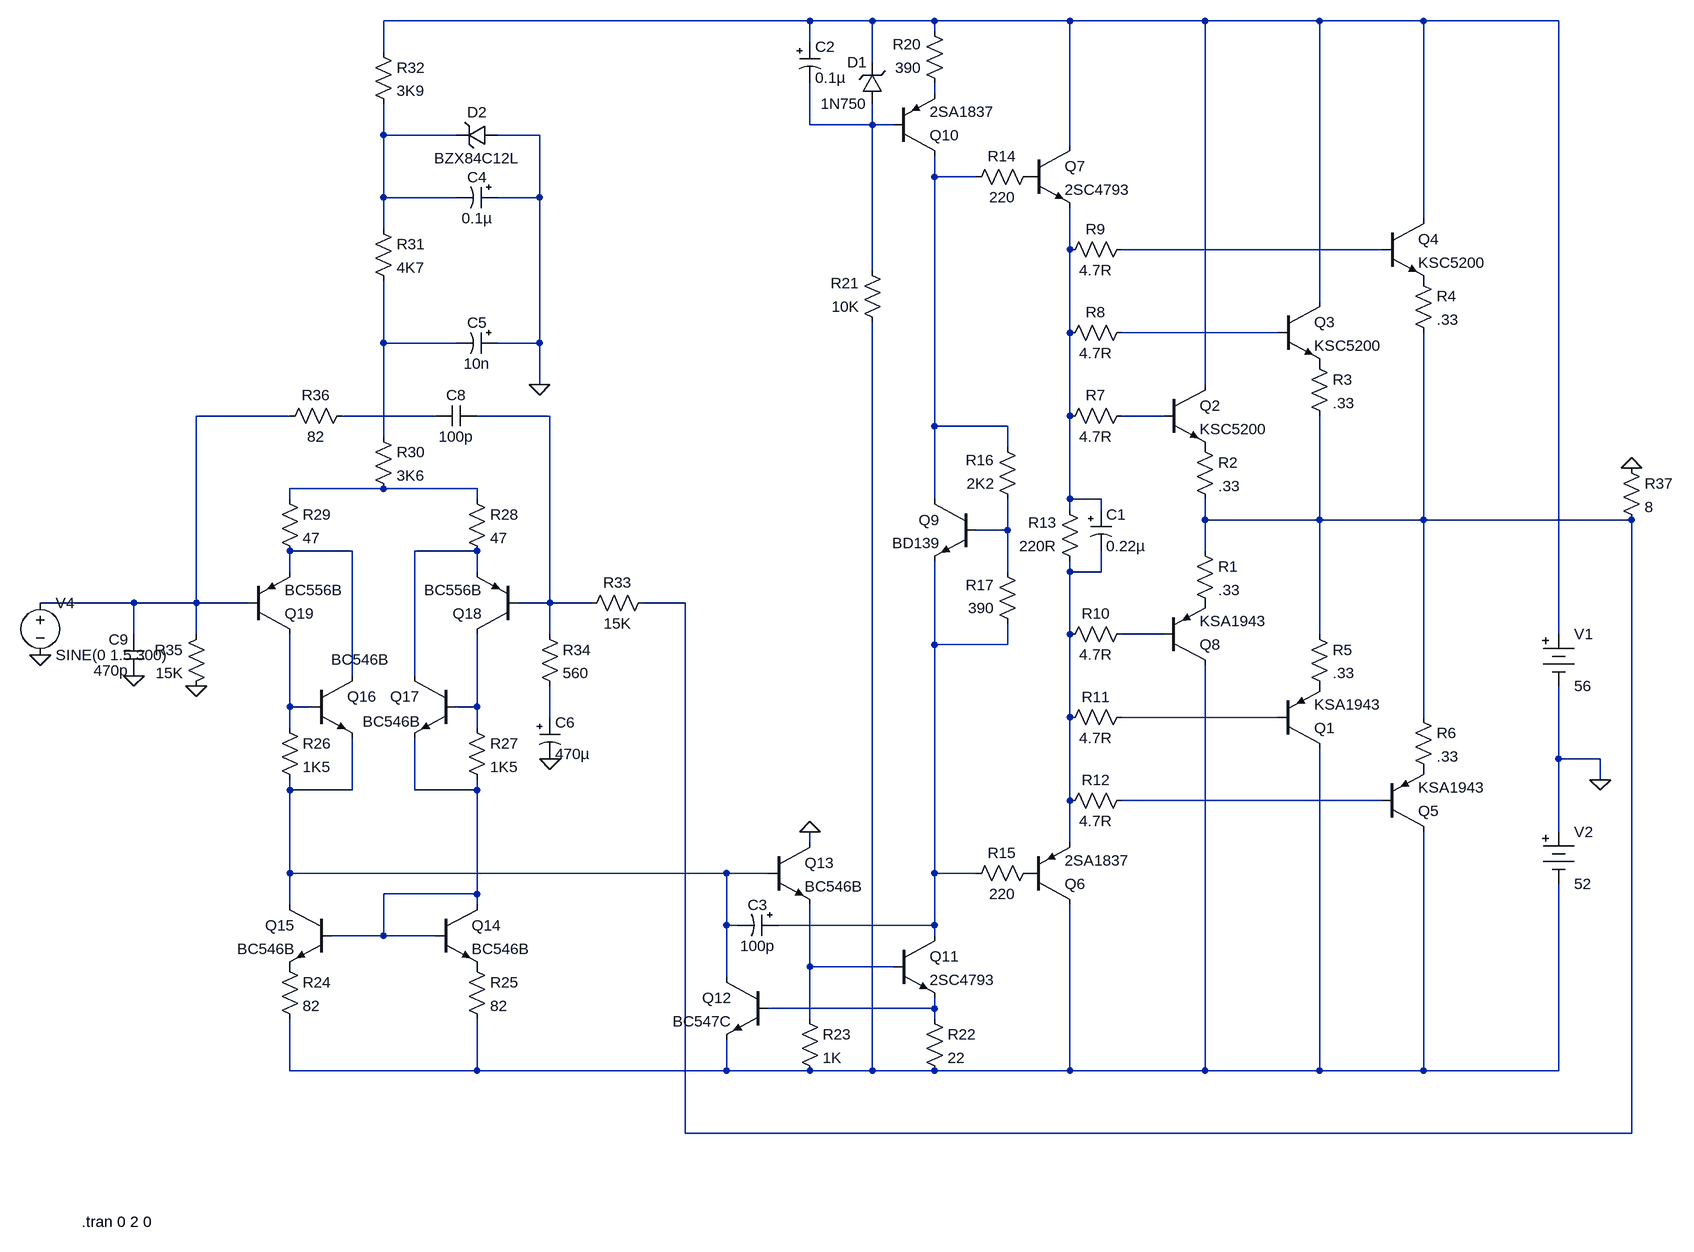
[diagram p0: schematic DXPRESI.asc]
DXPRESI.asc, the LTspice schematic file:
Version 4
SHEET 1 1768 1636
WIRE 272 -640 -384 -640
WIRE 368 -640 272 -640
WIRE 464 -640 368 -640
WIRE 672 -640 464 -640
WIRE 880 -640 672 -640
WIRE 1056 -640 880 -640
WIRE 1216 -640 1056 -640
WIRE 1424 -640 1216 -640
WIRE 464 -624 464 -640
WIRE 272 -608 272 -640
WIRE -384 -592 -384 -640
WIRE 368 -576 368 -640
WIRE 464 -528 464 -544
WIRE 272 -480 272 -544
WIRE 368 -480 368 -512
WIRE 368 -480 272 -480
WIRE 400 -480 368 -480
WIRE -384 -464 -384 -512
WIRE -272 -464 -384 -464
WIRE -144 -464 -208 -464
WIRE 672 -448 672 -640
WIRE 464 -400 464 -432
WIRE 528 -400 464 -400
WIRE -384 -368 -384 -464
WIRE -272 -368 -384 -368
WIRE -144 -368 -144 -464
WIRE -144 -368 -208 -368
WIRE 1216 -336 1216 -640
WIRE -384 -320 -384 -368
WIRE 672 -288 672 -352
WIRE 1152 -288 752 -288
WIRE 368 -256 368 -480
WIRE 1056 -208 1056 -640
WIRE 672 -160 672 -288
WIRE 992 -160 752 -160
WIRE -384 -144 -384 -240
WIRE -272 -144 -384 -144
WIRE -144 -144 -144 -368
WIRE -144 -144 -208 -144
WIRE -144 -80 -144 -144
WIRE 880 -80 880 -640
WIRE -528 -32 -672 -32
WIRE -304 -32 -448 -32
WIRE -128 -32 -240 -32
WIRE 672 -32 672 -160
WIRE 816 -32 752 -32
WIRE 464 -16 464 -400
WIRE 576 -16 464 -16
WIRE -384 0 -384 -144
WIRE 576 16 576 -16
WIRE -384 80 -528 80
WIRE -240 80 -384 80
WIRE -528 96 -528 80
WIRE -240 96 -240 80
WIRE 464 96 464 -16
WIRE 672 96 672 -32
WIRE 720 96 672 96
WIRE 672 112 672 96
WIRE 720 112 720 96
WIRE 880 128 880 96
WIRE 1056 128 1056 -32
WIRE 1056 128 880 128
WIRE 1216 128 1216 -160
WIRE 1216 128 1056 128
WIRE 1536 128 1216 128
WIRE 576 144 576 96
WIRE 576 144 528 144
WIRE -432 176 -528 176
WIRE -240 176 -336 176
WIRE 880 176 880 128
WIRE -528 208 -528 176
WIRE -240 208 -240 176
WIRE 576 208 576 144
WIRE 672 208 672 192
WIRE 720 208 720 176
WIRE 720 208 672 208
WIRE -768 256 -912 256
WIRE -672 256 -672 -32
WIRE -672 256 -768 256
WIRE -592 256 -672 256
WIRE -128 256 -128 -32
WIRE -128 256 -176 256
WIRE -64 256 -128 256
WIRE 80 256 16 256
WIRE -768 304 -768 256
WIRE -672 304 -672 256
WIRE -128 304 -128 256
WIRE 672 304 672 208
WIRE 816 304 752 304
WIRE 1056 304 1056 128
WIRE 1424 304 1424 -640
WIRE 464 320 464 192
WIRE 576 320 576 288
WIRE 576 320 464 320
WIRE -432 368 -432 176
WIRE -336 368 -336 176
WIRE -528 416 -528 304
WIRE -496 416 -528 416
WIRE -240 416 -240 304
WIRE -240 416 -272 416
WIRE -128 432 -128 384
WIRE 672 432 672 304
WIRE 992 432 752 432
WIRE 1216 432 1216 128
WIRE -528 448 -528 416
WIRE -240 448 -240 416
WIRE 1424 496 1424 384
WIRE 1488 496 1424 496
WIRE 1488 528 1488 496
WIRE -528 544 -528 528
WIRE -432 544 -432 464
WIRE -432 544 -528 544
WIRE -336 544 -336 464
WIRE -240 544 -240 528
WIRE -240 544 -336 544
WIRE 672 560 672 432
WIRE 1152 560 752 560
WIRE 1424 608 1424 496
WIRE 272 624 272 608
WIRE 672 624 672 560
WIRE -528 672 -528 544
WIRE 144 672 -528 672
WIRE 208 672 144 672
WIRE 464 672 464 320
WIRE 528 672 464 672
WIRE -240 704 -240 544
WIRE -240 704 -384 704
WIRE -528 720 -528 672
WIRE -240 720 -240 704
WIRE 144 752 144 672
WIRE 160 752 144 752
WIRE 464 752 464 672
WIRE 464 752 224 752
WIRE -384 768 -384 704
WIRE -384 768 -464 768
WIRE -304 768 -384 768
WIRE 464 768 464 752
WIRE 272 816 272 720
WIRE 400 816 272 816
WIRE 144 832 144 752
WIRE 464 880 464 864
WIRE 464 880 208 880
WIRE 272 896 272 816
WIRE 464 896 464 880
WIRE -528 976 -528 896
WIRE -240 976 -240 896
WIRE -240 976 -528 976
WIRE 144 976 144 928
WIRE 144 976 -240 976
WIRE 272 976 144 976
WIRE 368 976 368 -176
WIRE 368 976 272 976
WIRE 464 976 368 976
WIRE 672 976 672 720
WIRE 672 976 464 976
WIRE 880 976 880 352
WIRE 880 976 672 976
WIRE 1056 976 1056 480
WIRE 1056 976 880 976
WIRE 1216 976 1216 608
WIRE 1216 976 1056 976
WIRE 1424 976 1424 688
WIRE 1424 976 1216 976
WIRE 80 1072 80 256
WIRE 1536 1072 1536 128
WIRE 1536 1072 80 1072
FLAG 1488 528 0
FLAG 272 608 0
FLAG -144 -80 0
FLAG -128 496 0
FLAG -672 384 0
FLAG -768 368 0
FLAG 1536 48 0
FLAG -912 336 0
SYMBOL npn 816 -80 R0
SYMATTR InstName Q2
SYMATTR Value KSC5200
SYMBOL res 864 160 R0
SYMATTR InstName R1
SYMATTR Value .33
SYMBOL res 864 0 R0
SYMATTR InstName R2
SYMATTR Value .33
SYMBOL npn 992 -208 R0
SYMATTR InstName Q3
SYMATTR Value KSC5200
SYMBOL npn 1152 -336 R0
SYMATTR InstName Q4
SYMATTR Value KSC5200
SYMBOL res 1040 -128 R0
SYMATTR InstName R3
SYMATTR Value .33
SYMBOL res 1200 -256 R0
SYMATTR InstName R4
SYMATTR Value .33
SYMBOL res 1040 288 R0
SYMATTR InstName R5
SYMATTR Value .33
SYMBOL res 1200 416 R0
SYMATTR InstName R6
SYMATTR Value .33
SYMBOL battery 1424 288 R0
WINDOW 123 0 0 Left 2
WINDOW 39 0 0 Left 2
SYMATTR InstName V1
SYMATTR Value 56
SYMBOL battery 1424 592 R0
WINDOW 123 0 0 Left 2
WINDOW 39 0 0 Left 2
SYMATTR InstName V2
SYMATTR Value 52
SYMBOL res 768 -48 R90
WINDOW 0 0 56 VBottom 2
WINDOW 3 32 56 VTop 2
SYMATTR InstName R7
SYMATTR Value 4.7R
SYMBOL res 768 -176 R90
WINDOW 0 0 56 VBottom 2
WINDOW 3 32 56 VTop 2
SYMATTR InstName R8
SYMATTR Value 4.7R
SYMBOL res 768 -304 R90
WINDOW 0 0 56 VBottom 2
WINDOW 3 32 56 VTop 2
SYMATTR InstName R9
SYMATTR Value 4.7R
SYMBOL res 768 288 R90
WINDOW 0 0 56 VBottom 2
WINDOW 3 32 56 VTop 2
SYMATTR InstName R10
SYMATTR Value 4.7R
SYMBOL res 768 416 R90
WINDOW 0 0 56 VBottom 2
WINDOW 3 32 56 VTop 2
SYMATTR InstName R11
SYMATTR Value 4.7R
SYMBOL res 768 544 R90
WINDOW 0 0 56 VBottom 2
WINDOW 3 32 56 VTop 2
SYMATTR InstName R12
SYMATTR Value 4.7R
SYMBOL res 688 208 R180
WINDOW 0 36 76 Left 2
WINDOW 3 36 40 Left 2
SYMATTR InstName R13
SYMATTR Value 220R
SYMBOL polcap 704 112 R0
WINDOW 3 24 56 Left 2
SYMATTR Value 0.22µ
SYMATTR InstName C1
SYMATTR Description Capacitor
SYMATTR Type cap
SYMATTR SpiceLine V=50 Irms=22m Rser=3.9 Lser=0
SYMBOL npn 608 -448 R0
SYMATTR InstName Q7
SYMATTR Value 2SC4793
SYMBOL pnp 816 352 M180
SYMATTR InstName Q8
SYMATTR Value KSA1943
SYMBOL pnp 992 480 M180
SYMATTR InstName Q1
SYMATTR Value KSA1943
SYMBOL pnp 1152 608 M180
SYMATTR InstName Q5
SYMATTR Value KSA1943
SYMBOL pnp 608 720 M180
SYMATTR InstName Q6
SYMATTR Value 2SA1837
SYMBOL res 624 -416 R90
WINDOW 0 0 56 VBottom 2
WINDOW 3 32 56 VTop 2
SYMATTR InstName R14
SYMATTR Value 220
SYMBOL res 624 656 R90
WINDOW 0 0 56 VBottom 2
WINDOW 3 32 56 VTop 2
SYMATTR InstName R15
SYMATTR Value 220
SYMBOL npn 528 96 M0
SYMATTR InstName Q9
SYMATTR Value BD139
SYMBOL res 592 112 R180
WINDOW 0 36 76 Left 2
WINDOW 3 36 40 Left 2
SYMATTR InstName R16
SYMATTR Value 2K2
SYMBOL res 592 304 R180
WINDOW 0 36 76 Left 2
WINDOW 3 36 40 Left 2
SYMATTR InstName R17
SYMATTR Value 390
SYMBOL pnp 400 -432 M180
SYMATTR InstName Q10
SYMATTR Value 2SA1837
SYMBOL res 480 -528 R180
WINDOW 0 36 76 Left 2
WINDOW 3 36 40 Left 2
SYMATTR InstName R20
SYMATTR Value 390
SYMBOL zener 384 -512 R180
WINDOW 0 24 64 Left 2
WINDOW 3 24 0 Left 2
SYMATTR InstName D1
SYMATTR Value 1N750
SYMBOL polcap 256 -608 R0
WINDOW 3 24 56 Left 2
SYMATTR Value 0.1µ
SYMATTR InstName C2
SYMATTR Description Capacitor
SYMATTR Type cap
SYMATTR SpiceLine V=50 Irms=22m Rser=3.9 Lser=0
SYMBOL res 384 -160 R180
WINDOW 0 36 76 Left 2
WINDOW 3 36 40 Left 2
SYMATTR InstName R21
SYMATTR Value 10K
SYMBOL res 448 880 R0
SYMATTR InstName R22
SYMATTR Value 22
SYMBOL res 256 880 R0
SYMATTR InstName R23
SYMATTR Value 1K
SYMBOL npn 208 832 M0
SYMATTR InstName Q12
SYMATTR Value BC547C
SYMBOL polcap 224 736 R90
WINDOW 0 0 32 VBottom 2
WINDOW 3 32 32 VTop 2
SYMATTR InstName C3
SYMATTR Value 100p
SYMATTR Description Capacitor
SYMATTR Type cap
SYMATTR SpiceLine V=50 Irms=22m Rser=3.9 Lser=0
SYMBOL npn 400 768 R0
SYMATTR InstName Q11
SYMATTR Value 2SC4793
SYMBOL npn 208 624 R0
SYMATTR InstName Q13
SYMATTR Value BC546B
SYMBOL res -544 800 R0
SYMATTR InstName R24
SYMATTR Value 82
SYMBOL res -256 800 R0
SYMATTR InstName R25
SYMATTR Value 82
SYMBOL npn -304 720 R0
SYMATTR InstName Q14
SYMATTR Value BC546B
SYMBOL npn -464 720 M0
SYMATTR InstName Q15
SYMATTR Value BC546B
SYMBOL res -544 432 R0
SYMATTR InstName R26
SYMATTR Value 1K5
SYMBOL res -256 432 R0
SYMATTR InstName R27
SYMATTR Value 1K5
SYMBOL npn -496 368 R0
WINDOW 3 80 70 Left 2
SYMATTR Value BC546B
SYMATTR InstName Q16
SYMBOL npn -272 368 M0
WINDOW 3 103 -25 Left 2
SYMATTR Value BC546B
SYMATTR InstName Q17
SYMBOL pnp -176 304 R180
SYMATTR InstName Q18
SYMATTR Value BC556B
SYMBOL pnp -592 304 M180
SYMATTR InstName Q19
SYMATTR Value BC556B
SYMBOL res -256 80 R0
SYMATTR InstName R28
SYMATTR Value 47
SYMBOL res -544 80 R0
SYMATTR InstName R29
SYMATTR Value 47
SYMBOL res -400 -16 R0
SYMATTR InstName R30
SYMATTR Value 3K6
SYMBOL res -400 -336 R0
SYMATTR InstName R31
SYMATTR Value 4K7
SYMBOL res -400 -608 R0
SYMATTR InstName R32
SYMATTR Value 3K9
SYMBOL zener -208 -480 R90
WINDOW 0 -4 32 VBottom 2
WINDOW 3 36 32 VTop 2
SYMATTR InstName D2
SYMATTR Value BZX84C12L
SYMBOL polcap -208 -384 R90
WINDOW 0 0 32 VBottom 2
WINDOW 3 32 32 VTop 2
SYMATTR InstName C4
SYMATTR Value 0.1µ
SYMATTR Description Capacitor
SYMATTR Type cap
SYMATTR SpiceLine V=50 Irms=22m Rser=3.9 Lser=0
SYMBOL polcap -208 -160 R90
WINDOW 0 0 32 VBottom 2
WINDOW 3 32 32 VTop 2
SYMATTR InstName C5
SYMATTR Value 10n
SYMATTR Description Capacitor
SYMATTR Type cap
SYMATTR SpiceLine V=50 Irms=22m Rser=3.9 Lser=0
SYMBOL res 32 240 R90
WINDOW 0 0 56 VBottom 2
WINDOW 3 32 56 VTop 2
SYMATTR InstName R33
SYMATTR Value 15K
SYMBOL res -144 288 R0
SYMATTR InstName R34
SYMATTR Value 560
SYMBOL polcap -144 432 R0
WINDOW 3 24 56 Left 2
SYMATTR Value 470µ
SYMATTR InstName C6
SYMATTR Description Capacitor
SYMATTR Type cap
SYMATTR SpiceLine V=25 Irms=470m Rser=0.16 Lser=0 mfg="Nichicon" pn="UPR1E471MPH" type="Al electrolytic"
SYMBOL res -656 288 M0
SYMATTR InstName R35
SYMATTR Value 15K
SYMBOL cap -240 -48 R90
WINDOW 0 0 32 VBottom 2
WINDOW 3 32 32 VTop 2
SYMATTR InstName C8
SYMATTR Value 100p
SYMBOL cap -752 368 R180
WINDOW 0 24 56 Left 2
WINDOW 3 24 8 Left 2
SYMATTR InstName C9
SYMATTR Value 470p
SYMBOL res -432 -48 R90
WINDOW 0 0 56 VBottom 2
WINDOW 3 32 56 VTop 2
SYMATTR InstName R36
SYMATTR Value 82
SYMBOL res 1520 32 R0
SYMATTR InstName R37
SYMATTR Value 8
SYMBOL voltage -912 240 R0
WINDOW 123 0 0 Left 2
WINDOW 39 0 0 Left 2
SYMATTR InstName V4
SYMATTR Value SINE(0 1.5 300)
TEXT -848 1208 Left 2 !.tran 0 2 0

The netlist it stands for:
* DXPRESI.asc
Q2 N001 N013 P001 0 KSC5200
R1 N015 P002 .33
R2 P001 N015 .33
Q3 N001 N008 P003 0 KSC5200
Q4 N001 N007 P004 0 KSC5200
R3 P003 N015 .33
R4 P004 N015 .33
R5 N015 P005 .33
R6 N015 P006 .33
V1 N001 0 56
V2 0 N031 52
R7 N013 N006 4.7R
R8 N008 N006 4.7R
R9 N007 N006 4.7R
R10 N020 N019 4.7R
R11 N025 N019 4.7R
R12 N028 N019 4.7R
R13 N019 N006 220R
C1 N006 N019 0.22µ V=50 Irms=22m Rser=3.9 Lser=0
Q7 N001 P007 N006 0 2SC4793
Q8 N031 N020 P002 0 KSA1943
Q1 N031 N025 P005 0 KSA1943
Q5 N031 N028 P006 0 KSA1943
Q6 N031 P008 N019 0 2SA1837
R14 P007 N005 220
R15 P008 N021 220
Q9 N005 N016 N021 0 BD139
R16 N016 N005 2K2
R17 N021 N016 390
Q10 N005 N003 N002 0 2SA1837
R20 N002 N001 390
D1 N003 N001 1N750
C2 N001 N003 0.1µ V=50 Irms=22m Rser=3.9 Lser=0
R21 N031 N003 10K
R22 N030 N031 22
R23 N029 N031 1K
Q12 N026 N030 N031 0 BC547C
C3 N021 N026 100p V=50 Irms=22m Rser=3.9 Lser=0
Q11 N021 N029 N030 0 2SC4793
Q13 0 N026 N029 0 BC546B
R24 P009 N031 82
R25 P010 N031 82
Q14 N027 N027 P010 0 BC546B
Q15 N026 N027 P009 0 BC546B
R26 N022 N026 1K5
R27 N023 N027 1K5
Q16 N017 N022 N026 0 BC546B
Q17 N018 N023 N027 0 BC546B
Q18 N023 N012 N018 0 BC556B
Q19 N022 N010 N017 0 BC556B
R28 N014 N018 47
R29 N014 N017 47
R30 N009 N014 3K6
R31 N004 N009 4K7
R32 N001 N004 3K9
D2 0 N004 BZX84C12L
C4 0 N004 0.1µ V=50 Irms=22m Rser=3.9 Lser=0
C5 0 N009 10n V=50 Irms=22m Rser=3.9 Lser=0
R33 N015 N012 15K
R34 N012 N024 560
C6 N024 0 470µ V=25 Irms=470m Rser=0.16 Lser=0 mfg="Nichicon" pn="UPR1E471MPH" type="Al electrolytic"
R35 N010 0 15K
C8 N012 N011 100p
C9 0 N010 470p
R36 N011 N010 82
R37 0 N015 8
V4 N010 0 SINE(0 1.5 300)
.model D D
.lib standard.dio
.model NPN NPN
.model PNP PNP
.lib standard.bjt
.tran 0 2 0
.backanno
.end